# Altium schematic sheet Battery_Gate_Driver.SchDoc
size A4
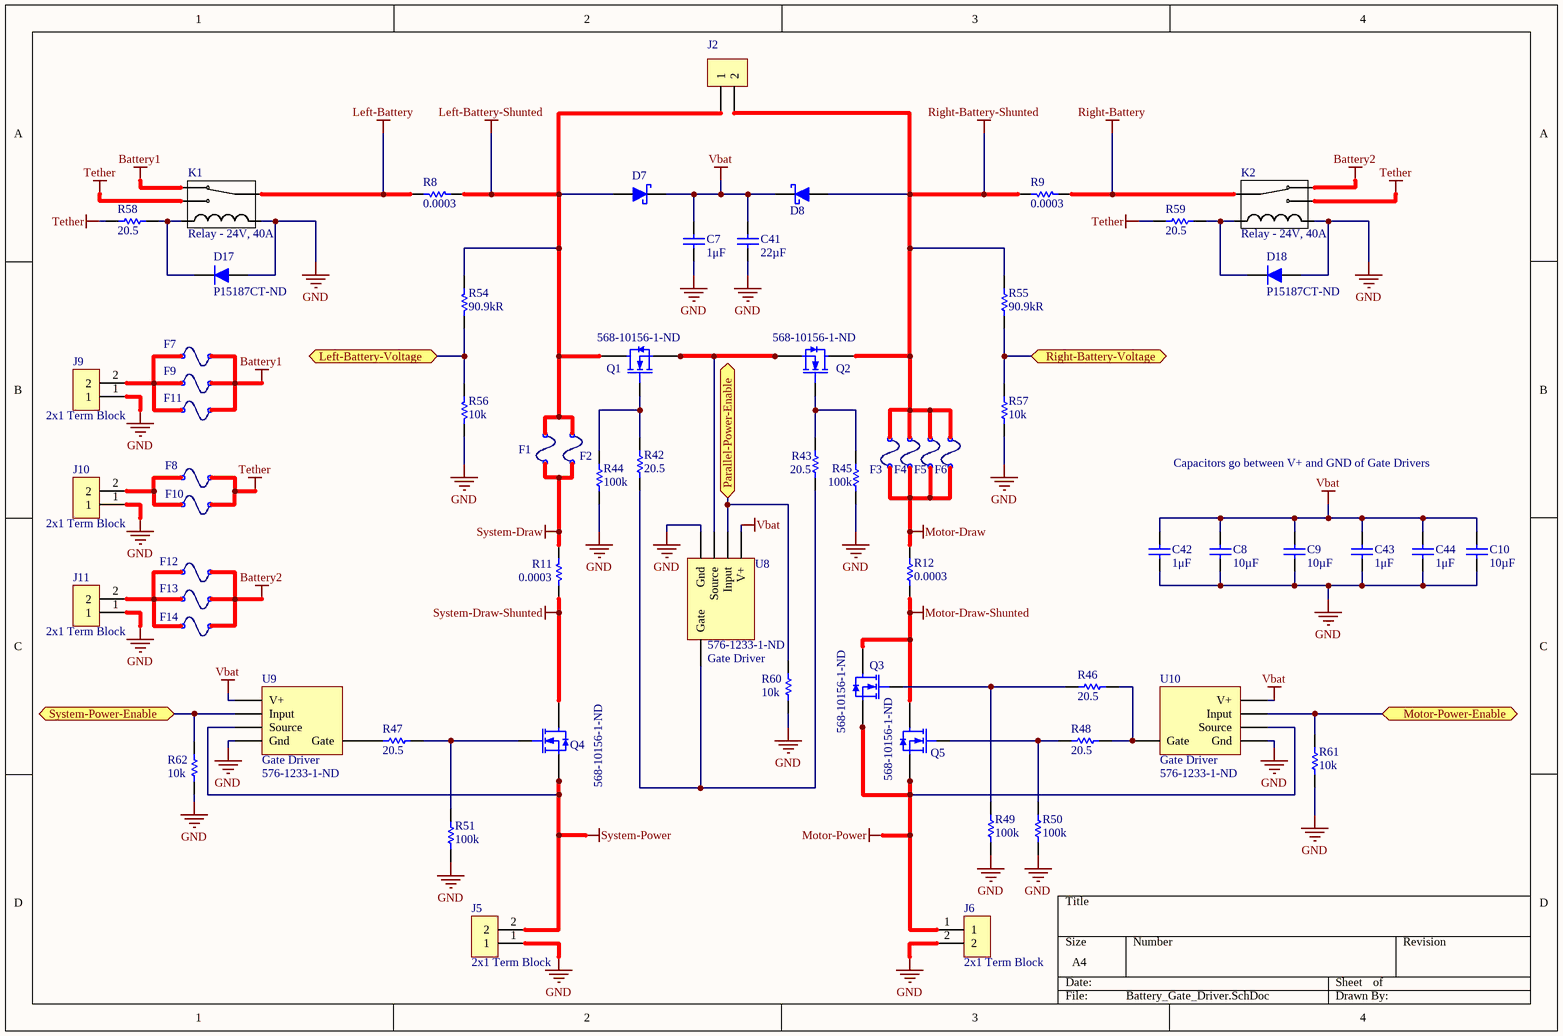
[diagram p0: Battery_Gate_Driver.SchDoc]

## Parts
C7  1μF  [CAPC1608N(0603")]
C8  10µF  [CAPC3216N(1206")]
C9  10µF  [CAPC3216N(1206")]
C10  10µF  [CAPC3216N(1206")]
C41  22µF  [CAPC2012N(0805")]
C42  1μF  [CAPC1608N(0603")]
C43  1μF  [CAPC1608N(0603")]
C44  1μF  [CAPC1608N(0603")]
D7  CUS08F30H3FCT-ND  [SC-76]  (value not drawn)
D8  CUS08F30H3FCT-ND  [SC-76]  (value not drawn)
D17  Supplier Part Number 1: P15187CT-ND  [SODFL535X110-2N]  (hidden comment: DA2S10400L, SOD323F / SC-90)  (no BOM)
D18  Supplier Part Number 1: P15187CT-ND  [SODFL535X110-2N]  (hidden comment: DA2S10400L, SOD323F / SC-90)  (no BOM)
F1  MINI  [MINI BLADE FUSEHOLDER]  (value not drawn)
F2  MINI  [MINI BLADE FUSEHOLDER]  (value not drawn)
F3  MINI  [MINI BLADE FUSEHOLDER]  (value not drawn)
F4  MINI  [MINI BLADE FUSEHOLDER]  (value not drawn)
F5  MINI  [MINI BLADE FUSEHOLDER]  (value not drawn)
F6  MINI  [MINI BLADE FUSEHOLDER]  (value not drawn)
F7  MINI  [MINI BLADE FUSEHOLDER]  (value not drawn)
F8  MINI  [MINI BLADE FUSEHOLDER]  (value not drawn)
F9  MINI  [MINI BLADE FUSEHOLDER]  (value not drawn)
F10  MINI  [MINI BLADE FUSEHOLDER]  (value not drawn)
F11  MINI  [MINI BLADE FUSEHOLDER]  (value not drawn)
F12  MINI  [MINI BLADE FUSEHOLDER]  (value not drawn)
F13  MINI  [MINI BLADE FUSEHOLDER]  (value not drawn)
F14  MINI  [MINI BLADE FUSEHOLDER]  (value not drawn)
J2  12AWG Wire Bridge  [12AWG Wire Bridge]  (value not drawn)
J5  2x1 Term Block  [2x1 Terminal Blocks EM2929]
J6  2x1 Term Block  [2x1 Terminal Blocks EM2929]
J9  2x1 Term Block  [2x1 Terminal Blocks EM2929]
J10  2x1 Term Block  [2x1 Terminal Blocks EM2929]
J11  2x1 Term Block  [2x1 Terminal Blocks EM2929]
K1  Relay - 24V, 40A  [1432871-1 Relay Footprint]
K2  Relay - 24V, 40A  [1432871-1 Relay Footprint]
Q1  Supplier Part Number 1: 568-10156-1-ND  [LFPAK-PowerSO8]  (hidden comment: MOSFET N-Channel, 40V, 100A, 272W)
Q2  Supplier Part Number 1: 568-10156-1-ND  [LFPAK-PowerSO8]  (hidden comment: MOSFET N-Channel, 40V, 100A, 272W)
Q3  Supplier Part Number 1: 568-10156-1-ND  [LFPAK-PowerSO8]  (hidden comment: MOSFET N-Channel, 40V, 100A, 272W)
Q4  Supplier Part Number 1: 568-10156-1-ND  [LFPAK-PowerSO8]  (hidden comment: MOSFET N-Channel, 40V, 100A, 272W)
Q5  Supplier Part Number 1: 568-10156-1-ND  [LFPAK-PowerSO8]  (hidden comment: MOSFET N-Channel, 40V, 100A, 272W)
R8  0.0003  [RESC6332N(2512")]
R9  0.0003  [RESC6332N(2512")]
R11  0.0003  [RESC6332N(2512")]
R12  0.0003  [RESC6332N(2512")]
R42  20.5  [RESC1608N(0603")]
R43  20.5  [RESC1608N(0603")]
R44  100k  [RESC2012N(0805")]
R45  100k  [RESC2012N(0805")]
R46  20.5  [RESC1608N(0603")]
R47  20.5  [RESC1608N(0603")]
R48  20.5  [RESC1608N(0603")]
R49  100k  [RESC2012N(0805")]
R50  100k  [RESC2012N(0805")]
R51  100k  [RESC2012N(0805")]
R54  90.9kR  [RESC1608N(0603")]
R55  90.9kR  [RESC1608N(0603")]
R56  10k  [RESC1608N(0603")]
R57  10k  [RESC1608N(0603")]
R58  20.5  [RESC1608N(0603")]
R59  20.5  [RESC1608N(0603")]
R60  10k  [RESC1608N(0603")]
R61  10k  [RESC1608N(0603")]
R62  10k  [RESC1608N(0603")]
U8  Gate Driver  Supplier Part Number 1: 576-1233-1-ND  [SOC 8]
U9  Gate Driver  Supplier Part Number 1: 576-1233-1-ND  [SOC 8]
U10  Gate Driver  Supplier Part Number 1: 576-1233-1-ND  [SOC 8]

## Ports
Left-Battery-Voltage, Motor-Power-Enable, Parallel-Power-Enable, Right-Battery-Voltage, System-Power-Enable

## Nets
Battery1: F7.2 F9.2 F11.2 K1.87a
Battery2: F12.2 F13.2 F14.2 K2.87a
GND: C7.1(Anode) C8.1(Anode) C9.1(Anode) C10.1(Anode) C41.1(Anode) C42.1(Anode) C43.1(Anode) C44.1(Anode) D17.1(Anode) D18.1(Anode) J5.1 J6.2 J9.1 J10.1 J11.1 K1.85 K2.86 R44.1 R45.1 R49.1 R50.1 R51.1 R56.2 R57.2 R60.2 R61.2 R62.2 U8.4(Gnd) U9.4(Gnd) U10.4(Gnd)
Left-Battery: K1.30 R8.2
Left-Battery-Shunted: D7.A(Anode) F1.2 F2.2 J2.1 Q1.5(Drain) R8.1 R54.1
Motor-Draw: F3.1 F4.1 F5.1 F6.1 R12.1
Motor-Draw-Shunted: Q3.5(Drain) Q5.5(Drain) R12.2
Motor-Power: J6.1 Q3.1(Source) Q3.2(Source) Q3.3(Source) Q5.1(Source) Q5.2(Source) Q5.3(Source) U10.3(Source)
Right-Battery: K2.30 R9.1
Right-Battery-Shunted: D8.A(Anode) F3.2 F4.2 F5.2 F6.2 J2.2 Q2.5(Drain) R9.2 R55.1
System-Draw: F1.1 F2.1 R11.2
System-Draw-Shunted: Q4.5(Drain) R11.1
System-Power: J5.2 Q4.1(Source) Q4.2(Source) Q4.3(Source) U9.3(Source)
Tether: F8.2 F10.2 K1.87 K2.87 R58.1 R59.1
Vbat: C7.2(Cathode) C8.2(Cathode) C9.2(Cathode) C10.2(Cathode) C41.2(Cathode) C42.2(Cathode) C43.2(Cathode) C44.2(Cathode) D7.K(Cathode) D8.K(Cathode) U8.1(V+) U9.1(V+) U10.1(V+)
Left-Battery-Voltage: R54.2 R56.1 ; port Left-Battery-Voltage
Motor-Power-Enable: R61.1 U10.2(Input) ; port Motor-Power-Enable
Parallel-Power-Enable: R60.1 U8.2(Input) ; port Parallel-Power-Enable
Right-Battery-Voltage: R55.2 R57.1 ; port Right-Battery-Voltage
System-Power-Enable: R62.1 U9.2(Input) ; port System-Power-Enable
NetD17_2: D17.2(Cathode) K1.86 R58.2
NetD18_2: D18.2(Cathode) K2.85 R59.2
NetF7_1: F7.1 F9.1 F11.1 J9.2
NetF8_1: F8.1 F10.1 J10.2
NetF12_1: F12.1 F13.1 F14.1 J11.2
NetQ1_1: Q1.1(Source) Q1.2(Source) Q1.3(Source) Q2.1(Source) Q2.2(Source) Q2.3(Source) U8.3(Source)
NetQ1_4: Q1.4(Gate) R42.2 R44.2
NetQ2_4: Q2.4(Gate) R43.2 R45.2
NetQ3_4: Q3.4(Gate) R46.2 R49.2
NetQ4_4: Q4.4(Gate) R47.1 R51.2
NetQ5_4: Q5.4(Gate) R48.2 R50.2
NetR42_1: R42.1 R43.1 U8.5(Gate)
NetR46_1: R46.1 R48.1 U10.5(Gate)
NetR47_2: R47.2 U9.5(Gate)

## Notes on the sheet
- Capacitors go between V+ and GND of Gate Drivers

## Library data of the parts
C7 C42-C44 = 1uF 50V 0603 SMD, Ceramic: Capacitor, Ceramic, 50V, +/- 10%, 0603 SMD, X5R; PackageDescription: Chip Capacitor; Value: 1μF; Created By: Lyden Smith; Date Created: 2017-10-26; Supplier 1: Digi-Key; Supplier Part Number 1: 1276-1860-6-ND
C8-C10 = 10uF 50V 1206 SMD, Ceramic: Capacitor, Ceramic, 50V, +/- 10%, 1206 SMD, X5R; Published: 14-06-01; Publisher: AUVic; PackageDescription: Chip Capacitor; Value: 10µF; Supplier 1: Digi-Key; Supplier Part Number 1: 1276-2876-1-ND
C41 = 22uF 35V 0805 SMD, Ceramic: Capacitor, Ceramic, 35V, +/- 20%, 0805 SMD, X5R; Published: 14-06-01; Publisher: AUVic; PackageDescription: Chip Capacitor; Value: 22µF; Supplier 1: Digi-Key; Supplier Part Number 1: 445-14428-1-ND
D7 D8 = CUS08F30H3FCT-ND: Diode, Schottky, 30V, 800mA; Created By: Andy Bates; Publisher: AUVic; Date Created: 2016-09-09; Supplier 1: Digi-Key; Supplier Part Number 1: CUS08F30H3FCT-ND
D17 D18 = DA2S10400L, SOD323F / SC-90: Forward Voltage Drop: 1.1V; Created By: Andy Bates; Publisher: AUVic; Date Created: 2016-09-08; Supplier 1: Digi-Key
F1-F14 = MINI, ATC, ATO, etc. Blade Fuse: Blade Fuse Holder, 30A; Created By: Lyden Smith; Date Created: 2018-01-11; Supplier 1: Digi-Key; Supplier Part Number 1: 36-3557-2-ND; Type: MINI
J5 J6 J9-J11 = 2x1 Terminal Block, 65A, 6-20AWG: Made by: Lyden Smith; Supplier 1: Digi-Key; Supplier Part Number 1: 283-4339-ND; Date Made: 2017-11-13
K1 K2 = Relay, 1 Form C, SPDT, 24V, 40A: Supplier 1: Digi-Key; Supplier Part Number 1: PB1042-ND
Q1-Q5 = MOSFET N-Channel, 40V, 100A, 272W: MOSFET N-Channel, 40V, 100A, 272W, Enh-Mode; MFG: NXP Semiconductors; MFG#: PSMN1R8-40YLC,115; Reviewed_By: Ashwin Sira; Latest_Revision_Note: Attached footprint; Created By: Ashwin Sira; Publisher: AUVic; Reviewed_Date: 2016_04_26; Latest_Revision_By: Ashwin Sira; Latest_Revision_Date: 2016_04_26; Supplier 1: Digi-Key
R8 R9 R11 R12 = 0.0003R, 1%, 3W, 2512 SMD: Made By: Ashwin Sira; Owned By: AUVic; Created On: 14-05-31; Last Edited: 14-05-31; Value: 0.0003; Supplier 1: Digi-Key
R42 R43 R46-R48 R58 R59 = 20.5 Ohm, 1%, 1/10W , 0603, SMD: Created By: Gabriel Green; Publisher: AUVic; Date Created: 2017-06-23; Value: 20.5; Supplier 1: Digi-Key; Supplier Part Number 1: P20.5HCT-ND
R44 R45 R49-R51 = 100kR, 1%, 1/4W, 0805 SMD: Made By: Ashwin Sira; Owned By: AUVic; Created On: 14-05-31; Last Edited: 14-05-31; Value: 100k; Supplier 1: Digi-Key; Supplier Part Number 1: 311-1.00MCRCT-ND
R54 R55 = 90.9k, 1%, 1/10W, 0603, SMD: Created By: Andy Bates; Publisher: AUVic; Date Created: 2017-06-06; Value: 90.9kR; Supplier 1: Digikey; Supplier Part Number 1: 311-90.9KHRDKR-ND
R56 R57 R60-R62 = 10kR, 1%, 1/10W, 0603 SMD: Made By: Ashwin Sira; Owned By: AUVic; Created On: 14-05-31; Last Edited: 14-05-31; Supplier 1: Digi-Key; Supplier Part Number 1: 311-10.0KHRCT-ND; Value: 10k
U8-U10 = Gate Driver TTL Logic 3 - 30V: Supplier 1: Digi-Key
J2 = 12AWG Wire Bridge: Created By: Lyden Smith; Created On: 2018-01-29